# Altium project ALCT_MEZ_LX150T.PrjPcb (part 3 of 5)

## Sheet MGT.SchDoc: FPGA MGTs
size B; Organization: UCLA High Energy Physics; DocumentNumber: 6; Revision: 2.0; SheetNumber: 6; SheetTotal: 12
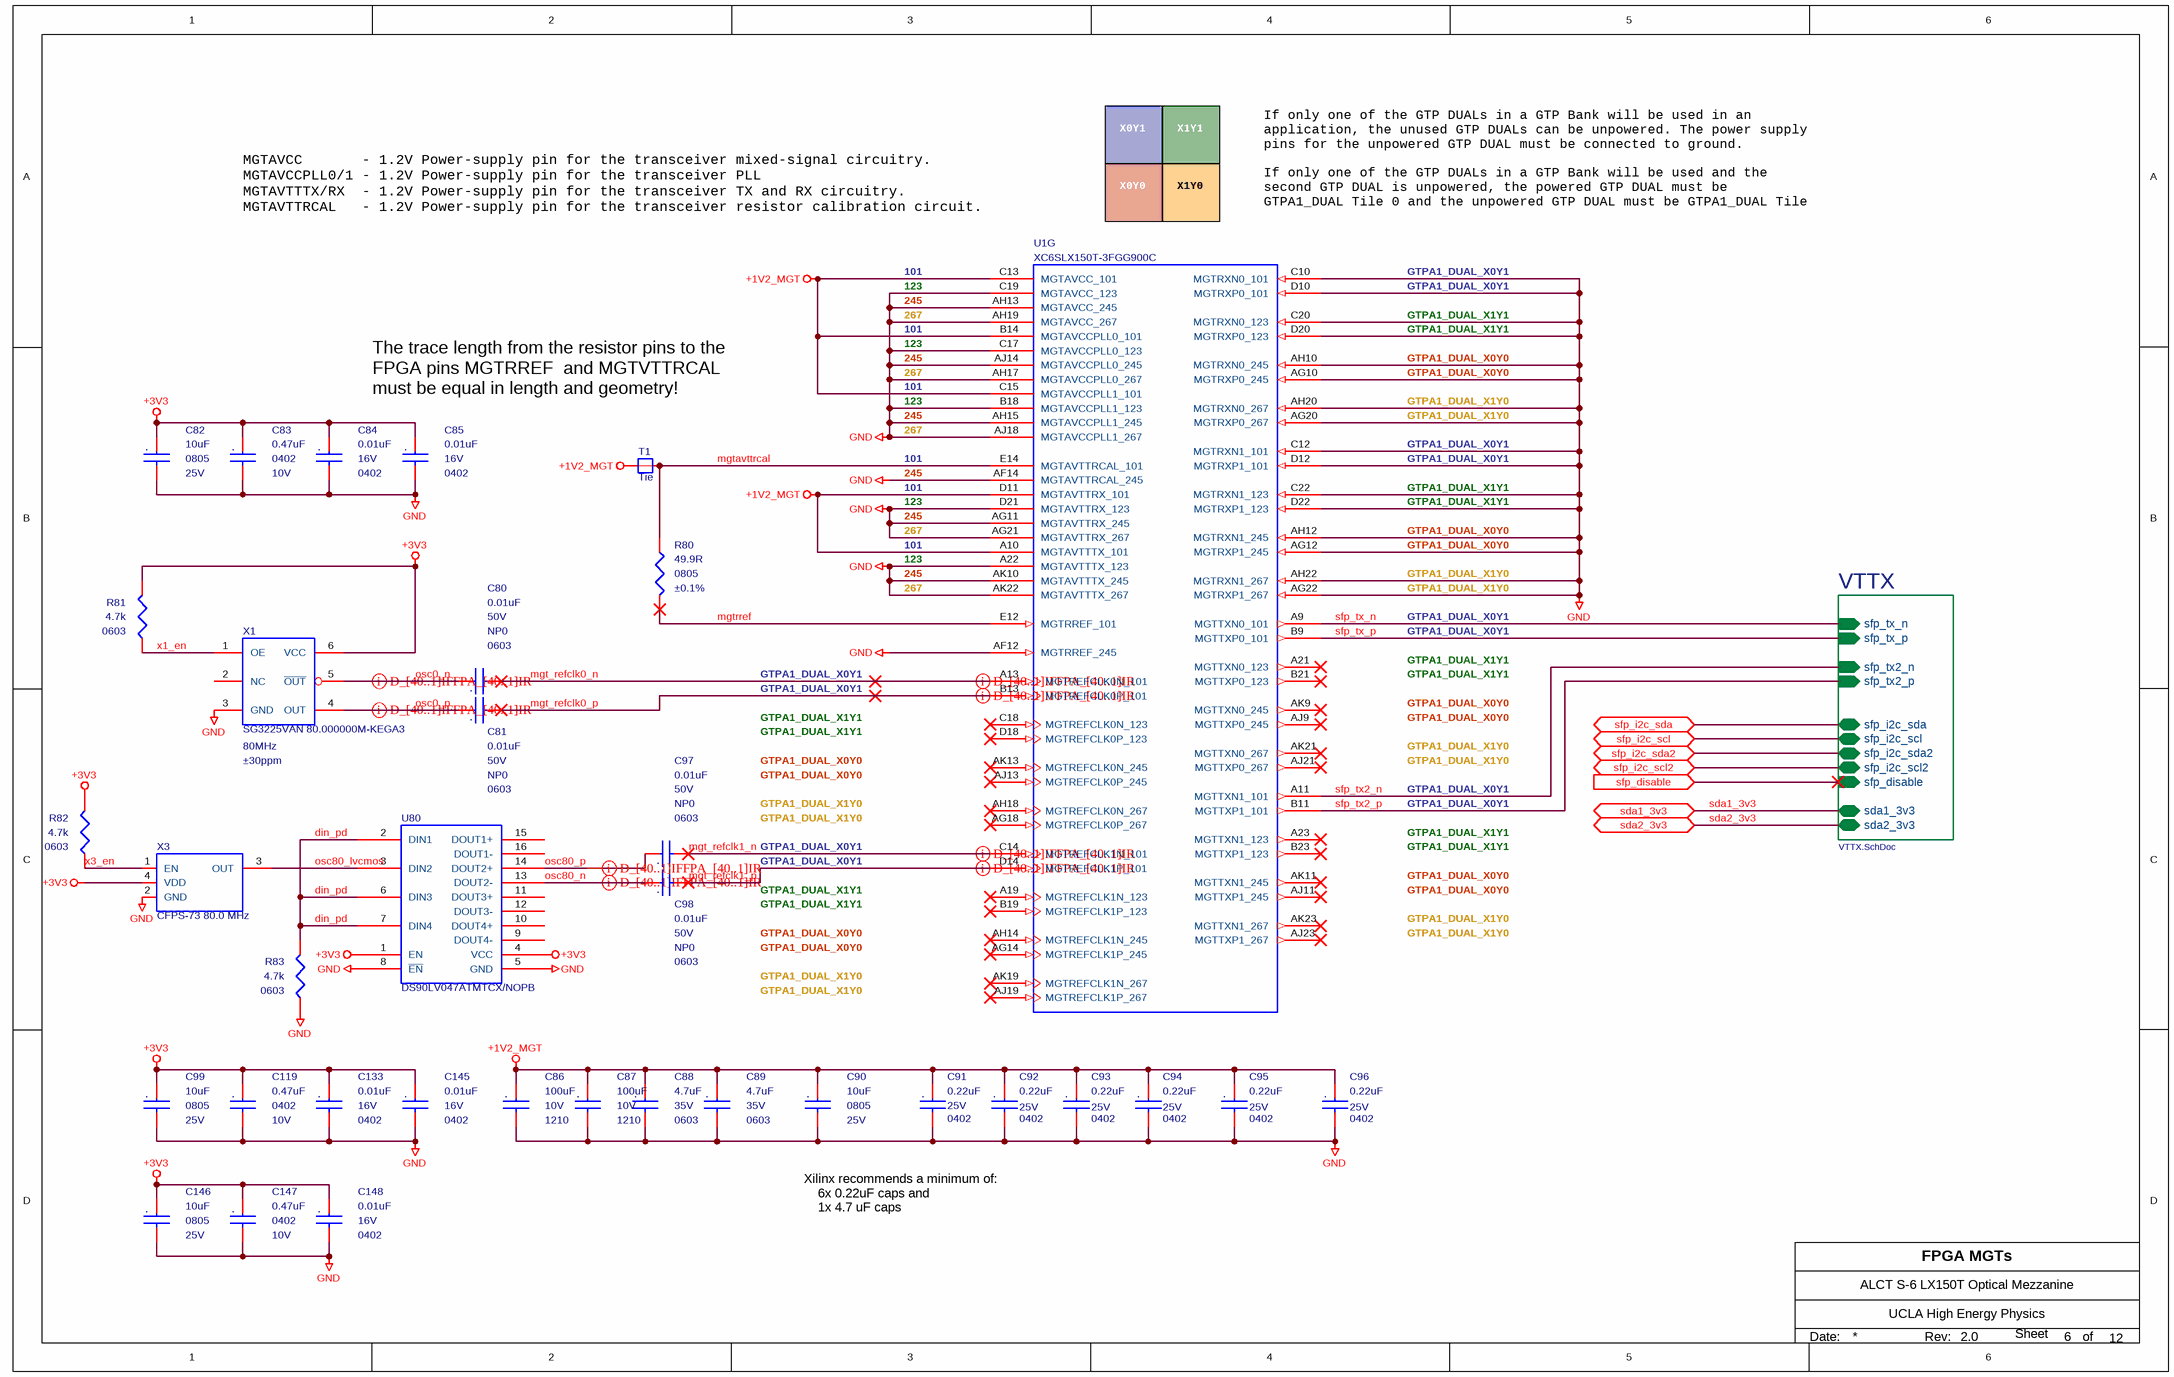
[diagram p10: MGT.SchDoc]

### Parts
C80  0.01uF  Temperature Coefficient: NP0  package: 0603  Voltage - Rated: 50V  [MC_S6/SM/C_0603_IPC]
C81  0.01uF  Temperature Coefficient: NP0  package: 0603  Voltage - Rated: 50V  [MC_S6/SM/C_0603_IPC]
C82  10uF  Voltage - Rated: 25V  package: 0805  [MC_S6/SM/C_0805_IPC]
C83  0.47uF  Voltage - Rated: 10V  package: 0402  [MC_S6/SM/C_0402_IPC]
C84  0.01uF  Voltage - Rated: 16V  package: 0402  [MC_S6/SM/C_0402_IPC]
C85  0.01uF  Voltage - Rated: 16V  package: 0402  [MC_S6/SM/C_0402_IPC]
C86  100uF  Voltage - Rated: 10V  package: 1210  [MC_S6/SM/C_1210_IPC]
C87  100uF  Voltage - Rated: 10V  package: 1210  [MC_S6/SM/C_1210_IPC]
C88  4.7uF  Voltage - Rated: 35V  package: 0603  [MC_S6/SM/C_0603_IPC]
C89  4.7uF  Voltage - Rated: 35V  package: 0603  [MC_S6/SM/C_0603_IPC]
C90  10uF  Voltage - Rated: 25V  package: 0805  [MC_S6/SM/C_0805_IPC]
C91  0.22uF  Voltage - Rated: 25V  package: 0402  [MC_S6/SM/C_0402_IPC]
C92  0.22uF  Voltage - Rated: 25V  package: 0402  [MC_S6/SM/C_0402_IPC]
C93  0.22uF  Voltage - Rated: 25V  package: 0402  [MC_S6/SM/C_0402_IPC]
C94  0.22uF  Voltage - Rated: 25V  package: 0402  [MC_S6/SM/C_0402_IPC]
C95  0.22uF  Voltage - Rated: 25V  package: 0402  [MC_S6/SM/C_0402_IPC]
C96  0.22uF  Voltage - Rated: 25V  package: 0402  [MC_S6/SM/C_0402_IPC]
C97  0.01uF  Temperature Coefficient: NP0  package: 0603  Voltage - Rated: 50V  [MC_S6/SM/C_0603_IPC]
C98  0.01uF  Temperature Coefficient: NP0  package: 0603  Voltage - Rated: 50V  [MC_S6/SM/C_0603_IPC]
C99  10uF  Voltage - Rated: 25V  package: 0805  [MC_S6/SM/C_0805_IPC]
C119  0.47uF  Voltage - Rated: 10V  package: 0402  [MC_S6/SM/C_0402_IPC]
C133  0.01uF  Voltage - Rated: 16V  package: 0402  [MC_S6/SM/C_0402_IPC]
C145  0.01uF  Voltage - Rated: 16V  package: 0402  [MC_S6/SM/C_0402_IPC]
C146  10uF  Voltage - Rated: 25V  package: 0805  [MC_S6/SM/C_0805_IPC]
C147  0.47uF  Voltage - Rated: 10V  package: 0402  [MC_S6/SM/C_0402_IPC]
C148  0.01uF  Voltage - Rated: 16V  package: 0402  [MC_S6/SM/C_0402_IPC]
R80  49.9R  Tolerance: ±0.1%  Supplier Device Package: 0805  [MC_S6/SM/R_0805_IPC]
R81  4.7k  Supplier Device Package: 0603  [MC_S6/SM/R_0603_IPC]
R82  4.7k  Supplier Device Package: 0603  [MC_S6/SM/R_0603_IPC]
R83  4.7k  Supplier Device Package: 0603  [MC_S6/SM/R_0603_IPC]
T1  Tie  [MC_S6/TH/TIE_VIA]  (net tie, no BOM)
U1  XC6SLX150T-3FGG900C  [MC_S6/BGA/FGG900]  (part G of 13)
U80  DS90LV047ATMTCX/NOPB  [MC_S6/SM/TSSOP16]
X1  SG3225VAN 80.000000M-KEGA3  Frequency: 80MHz  Frequency Stability: ±30ppm  [MC_S6/SM/XTAL-LVDS-3.2-2.5]
X3  CFPS-73 80.0 MHz  [MC_S6/SM/XTAL-7x5.08]

### Sub-sheets
VTTX = VTTX.SchDoc: sfp_tx2_n (in), sfp_tx2_p (in), sfp_i2c_sda2 (bidir), sfp_i2c_scl (bidir), sfp_i2c_sda (bidir), sfp_i2c_scl2 (bidir), sfp_tx_n (in), sfp_tx_p (in), sfp_disable (in), sda2_3v3 (bidir), sda1_3v3 (bidir)

### Ports
sda1_3v3 (bidir), sda2_3v3 (bidir), sfp_disable (in), sfp_i2c_scl2 (bidir), sfp_i2c_scl (bidir), sfp_i2c_sda2 (bidir), sfp_i2c_sda (bidir)

### Nets
+1V2_MGT: C86.1 C87.1 C88.1 C89.1 C90.1 C91.1 C92.1 C93.1 C94.1 C95.1 C96.1 T1.2 U1.A10(MGTAVTTTX_101) U1.B14(MGTAVCCPLL0_101) U1.C13(MGTAVCC_101) U1.C15(MGTAVCCPLL1_101) U1.D11(MGTAVTTRX_101)
+3V3: C82.1 C83.1 C84.1 C85.1 C99.1 C119.1 C133.1 C145.1 C146.1 C147.1 C148.1 R81.1 R82.1 U80.1(EN) U80.4(VCC) X1.6(VCC) X3.4(VDD)
GND: C82.2 C83.2 C84.2 C85.2 C86.2 C87.2 C88.2 C89.2 C90.2 C91.2 C92.2 C93.2 C94.2 C95.2 C96.2 C99.2 C119.2 C133.2 C145.2 C146.2 C147.2 C148.2 R83.2 U1.A22(MGTAVTTTX_123) U1.AF12(MGTRREF_245) U1.AF14(MGTAVTTRCAL_245) U1.AG10(MGTRXP0_245) U1.AG11(MGTAVTTRX_245) U1.AG12(MGTRXP1_245) U1.AG20(MGTRXP0_267) U1.AG21(MGTAVTTRX_267) U1.AG22(MGTRXP1_267) U1.AH10(MGTRXN0_245) U1.AH12(MGTRXN1_245) U1.AH13(MGTAVCC_245) U1.AH15(MGTAVCCPLL1_245) U1.AH17(MGTAVCCPLL0_267) U1.AH19(MGTAVCC_267) U1.AH20(MGTRXN0_267) U1.AH22(MGTRXN1_267) U1.AJ14(MGTAVCCPLL0_245) U1.AJ18(MGTAVCCPLL1_267) U1.AK10(MGTAVTTTX_245) U1.AK22(MGTAVTTTX_267) U1.B18(MGTAVCCPLL1_123) U1.C10(MGTRXN0_101) U1.C12(MGTRXN1_101) U1.C17(MGTAVCCPLL0_123) U1.C19(MGTAVCC_123) U1.C20(MGTRXN0_123) U1.C22(MGTRXN1_123) U1.D10(MGTRXP0_101) U1.D12(MGTRXP1_101) U1.D20(MGTRXP0_123) U1.D21(MGTAVTTRX_123) U1.D22(MGTRXP1_123) U80.5(GND) U80.8(~{EN}) X1.3(GND) X3.2(GND)
din_pd: R83.1 U80.2(DIN1) U80.6(DIN3) U80.7(DIN4)
mgt_refclk0_n: C80.2 U1.A13(MGTREFCLK0N_101)
mgt_refclk0_p: C81.2 U1.B13(MGTREFCLK0P_101)
mgt_refclk1_n: C97.2 U1.C14(MGTREFCLK1N_101)
mgt_refclk1_p: C98.2 U1.D14(MGTREFCLK1P_101)
mgtavttrcal: R80.1 T1.1 U1.E14(MGTAVTTRCAL_101)
mgtrref: R80.2 U1.E12(MGTRREF_101)
osc0_n: C80.1 X1.5(~{OUT})
osc0_p: C81.1 X1.4(OUT)
osc80_lvcmos: U80.3(DIN2) X3.3(OUT)
osc80_n: C98.1 U80.13(DOUT2-)
osc80_p: C97.1 U80.14(DOUT2+)
sda1_3v3: port sda1_3v3, sheet VTTX/sda1_3v3
sda2_3v3: port sda2_3v3, sheet VTTX/sda2_3v3
sfp_disable: port sfp_disable, sheet VTTX/sfp_disable
sfp_i2c_scl: port sfp_i2c_scl, sheet VTTX/sfp_i2c_scl
sfp_i2c_scl2: port sfp_i2c_scl2, sheet VTTX/sfp_i2c_scl2
sfp_i2c_sda: port sfp_i2c_sda, sheet VTTX/sfp_i2c_sda
sfp_i2c_sda2: port sfp_i2c_sda2, sheet VTTX/sfp_i2c_sda2
sfp_tx2_n: U1.A11(MGTTXN1_101) ; sheet VTTX/sfp_tx2_n
sfp_tx2_p: U1.B11(MGTTXP1_101) ; sheet VTTX/sfp_tx2_p
sfp_tx_n: U1.A9(MGTTXN0_101) ; sheet VTTX/sfp_tx_n
sfp_tx_p: U1.B9(MGTTXP0_101) ; sheet VTTX/sfp_tx_p
x1_en: R81.2 X1.1(OE)
x3_en: R82.2 X3.1(EN)

Not connected (* = marked no-connect by the designer): U1 A19(MGTREFCLK1N_123)* A21(MGTTXN0_123)* A23(MGTTXN1_123)* AG14(MGTREFCLK1P_245)* AG18(MGTREFCLK0P_267)* AH14(MGTREFCLK1N_245)* AH18(MGTREFCLK0N_267)* AJ9(MGTTXP0_245)* AJ11(MGTTXP1_245)* AJ13(MGTREFCLK0P_245)* AJ19(MGTREFCLK1P_267)* AJ21(MGTTXP0_267)* AJ23(MGTTXP1_267)* AK9(MGTTXN0_245)* AK11(MGTTXN1_245)* AK13(MGTREFCLK0N_245)* AK19(MGTREFCLK1N_267)* AK21(MGTTXN0_267)* AK23(MGTTXN1_267)* B19(MGTREFCLK1P_123)* B21(MGTTXP0_123)* B23(MGTTXP1_123)* C18(MGTREFCLK0N_123)* D18(MGTREFCLK0P_123)*; U80 9(DOUT4-) 10(DOUT4+) 11(DOUT3+) 12(DOUT3-) 15(DOUT1+) 16(DOUT1-); X1 2(NC)

### Layout directives
differential pair: mgt_refclk0_n, mgt_refclk0_p, mgt_refclk1_n, mgt_refclk1_p, osc0_n, osc0_p, osc80_n, osc80_p

### Notes on the sheet
- X0Y1
- X1Y1
- (near U1) MGTAVCC       - 1.2V Power-supply pin for the transceiver mixed-signal circuitry.
  MGTAVCCPLL0/1 - 1.2V Power-supply pin for the transceiver PLL
  MGTAVTTTX/RX  - 1.2V Power-supply pin for the transceiver TX and RX circuitry.
  MGTAVTTRCAL   - 1.2V Power-supply pin for the transceiver resistor calibration circuit.
- X0Y0
- X1Y0
- If only one of the GTP DUALs in a GTP Bank will be used in an application, the unused GTP DUALs can be unpowered. The power supply pins for the unpowered GTP DUAL must be connected to ground.
  If only one of the GTP DUALs in a GTP Bank will be used and the second GTP DUAL is unpowered, the powered GTP DUAL must be GTPA1_DUAL Tile 0 and the unpowered GTP DUAL must be GTPA1_DUAL Tile 1.
- 101
- 123
- 245
- 267
- GTPA1_DUAL_X0Y1
- GTPA1_DUAL_X1Y1
- GTPA1_DUAL_X0Y0
- (near C85) The trace length from the resistor pins to the FPGA pins MGTRREF  and MGTVTTRCAL must be equal in length and geometry!
- GTPA1_DUAL_X1Y0
- Xilinx recommends a minimum of:
  6x 0.22uF caps and
  1x 4.7 uF caps
- Date:
- Rev:
- of
- Sheet
- (in symbol C0402C103K4RACTU) .
- (in symbol C0603C103J3GACTU) .
- (in symbol GRM21BR61E106KA73L) .
- (in symbol GRM155R61A474KE15J) .
- (in symbol GRM155R71C224KA12D) .
- (in symbol GRM188R6YA475KE15D) .
- (in symbol LMK325BJ107MM-T) .

### Library data of the parts
C80 C81 C97 C98 = C0603C103J3GACTU: CAP CER 10000PF 50V NP0 0603; Manufacturer: KEMET; Tolerance: ±5%; Supplier 1: Digi-Key; Manufacturer Part Number: C0603C103J3GACTU; RoHS: RoHS Compliant; Category: Capacitors; Stock 1: 190820; Pricing 1: 1=0.33, 10=0.231, 100=0.1385, 500=0.10388, 1000=0.08772 (USD); Packaging: Cut Tape (CT); Part Status: Active; Capacitance: 10000pF; Operating Temperature: -55°C ~ 125°C; Features: Low ESL; Ratings: -; Applications: General Purpose; Mounting Type: Surface Mount, MLCC; Package / Case: 0603 (1608 Metric); Size / Dimension: 0.063" L x 0.031" W (1.60mm x 0.80mm); Height - Seated (Max): -; Thickness (Max): 0.034" (0.87mm); Lead Spacing: -; Lead Style: -; ComponentLink1URL: http://www.kemet.com/docfinder?Partnumber=C0603C103J3GACTU; ComponentLink1Description: http://www.kemet.com/docfinder?Partnumber=C0603C103J3GACTU; Supplier 2: Digi-Key; Stock 2: 190820; Pricing 2: 1=0.33, 10=0.231, 100=0.1385, 500=0.10388, 1000=0.08772 (USD); Supplier Part Number 1: 399-7838-1-ND; Supplier Part Number 2: 399-7838-6-ND; Failure Rate: -
C82 C90 C99 C146 = GRM21BR61E106KA73L: CAP CER 10UF 25V X5R 0805; Manufacturer: Murata Electronics North America; Capacitance: 10µF; Tolerance: ±10%; Supplier 1: Digi-Key; Manufacturer Part Number: GRM21BR61E106KA73L; RoHS: RoHS Compliant; Category: Capacitors; Stock 1: 607428; Pricing 1: 1=0.19, 10=0.13, 50=0.0748, 100=0.0618, 250=0.052, 500=0.04356, 1000=0.03575 (USD); Packaging: Cut Tape (CT); Part Status: Active; Temperature Coefficient: X5R; Operating Temperature: -55°C ~ 85°C; Features: -; Ratings: -; Applications: General Purpose; Mounting Type: Surface Mount, MLCC; Package / Case: 0805 (2012 Metric); Size / Dimension: 0.079" L x 0.049" W (2.00mm x 1.25mm); Height - Seated (Max): -; Thickness (Max): 0.053" (1.35mm); Lead Spacing: -; Lead Style: -; ComponentLink1URL: http://www.murata.com/~/media/webrenewal/support/library/catalog/products/capacitor/mlcc/c02e.pdf; ComponentLink1Description: http://www.murata.com/~/media/webrenewal/support/library/catalog/products/capacitor/mlcc/c02e.pdf; Supplier 2: Digi-Key; Supplier Part Number 1: 490-5523-1-ND; Supplier Part Number 2: 490-5523-6-ND
C83 C119 C147 = GRM155R61A474KE15J: CAP CER 0.47UF 10V X5R 0402; Manufacturer: Murata Electronics North America; Capacitance: 0.47µF; Tolerance: ±10%; Supplier 1: Digi-Key; Manufacturer Part Number: GRM155R61A474KE15J; RoHS: RoHS Compliant; Category: Capacitors; Stock 1: 35266; Pricing 1: 1=0.1, 10=0.074, 100=0.0329, 500=0.02348, 1000=0.01845, 2500=0.01678, 5000=0.01543 (USD); Packaging: Cut Tape (CT); Part Status: Active; Operating Temperature: -55°C ~ 85°C; Features: -; Ratings: -; Applications: General Purpose; Mounting Type: Surface Mount, MLCC; Package / Case: 0402 (1005 Metric); Size / Dimension: 0.039" L x 0.020" W (1.00mm x 0.50mm); Height - Seated (Max): -; Thickness (Max): 0.022" (0.55mm); Lead Spacing: -; ComponentLink1URL: http://www.murata.com/~/media/webrenewal/support/library/catalog/products/capacitor/mlcc/c02e.ashx; ComponentLink1Description: http://www.murata.com/~/media/webrenewal/support/library/catalog/products/capacitor/mlcc/c02e.ashx; Supplier 2: Digi-Key; Stock 2: 35286; Pricing 2: 1=0.1, 10=0.074, 100=0.0329, 500=0.02348, 1000=0.01845, 2500=0.01678, 5000=0.01543 (USD); Supplier Part Number 1: 490-6305-1-ND; Supplier Part Number 2: 490-6305-6-ND; Temperature Coefficient: X5R
C84 C85 C133 C145 C148 = C0402C103K4RACTU: CAP CER 10nF 16V X7R 0402; Manufacturer: KEMET; Capacitance: 10000pF; Tolerance: ±10%; Supplier 1: Digi-Key; Manufacturer Part Number: C0402C103K4RACTU; RoHS: RoHS Compliant; Category: Capacitors; Stock 1: 605739; Pricing 1: 1=0.1, 10=0.02, 25=0.0144, 50=0.0108, 100=0.0088, 250=0.00732, 500=0.00626, 1000=0.00492, 5000=0.00412 (USD); Packaging: Cut Tape (CT); Part Status: Active; Temperature Coefficient: X7R; Operating Temperature: -55°C ~ 125°C; Features: -; Ratings: -; Applications: General Purpose; Failure Rate: -; Mounting Type: Surface Mount, MLCC; Package / Case: 0402 (1005 Metric); Size / Dimension: 0.039" L x 0.020" W (1.00mm x 0.50mm); Height - Seated (Max): -; Thickness (Max): 0.022" (0.55mm); Lead Spacing: -; Lead Style: -; ComponentLink1URL: http://www.kemet.com/docfinder?Partnumber=C0402C103K4RACTU; ComponentLink1Description: http://www.kemet.com/docfinder?Partnumber=C0402C103K4RACTU; Supplier 2: Digi-Key; Stock 2: 605739; Pricing 2: 1=0.1, 10=0.02, 25=0.0144, 50=0.0108, 100=0.0088, 250=0.00732, 500=0.00626, 1000=0.00492, 5000=0.00412 (USD); Supplier Part Number 1: 399-1038-1-ND; Supplier Part Number 2: 399-1038-6-ND
C86 C87 = LMK325BJ107MM-T: CAP CER 100UF 10V X5R 1210; Manufacturer: Taiyo Yuden; Capacitance: 100µF; Tolerance: ±20%; Supplier 1: Digi-Key; Manufacturer Part Number: LMK325BJ107MM-T; RoHS: RoHS Compliant; Category: Capacitors; Stock 1: 345948; Pricing 1: 1=1.15, 10=0.909, 25=0.8332, 50=0.7878, 100=0.6818, 250=0.60608 (USD); Packaging: Cut Tape (CT); Part Status: Active; Temperature Coefficient: X5R; Operating Temperature: -55°C ~ 85°C; Features: -; Ratings: -; Applications: General Purpose; Mounting Type: Surface Mount, MLCC; Package / Case: 1210 (3225 Metric); Size / Dimension: 0.126" L x 0.098" W (3.20mm x 2.50mm); Height - Seated (Max): -; Thickness (Max): 0.106" (2.70mm); Lead Spacing: -; Lead Style: -; ComponentLink1URL: http://www.yuden.co.jp/productdata/catalog/en/mlcc_all_e.pdf; ComponentLink1Description: http://www.yuden.co.jp/productdata/catalog/en/mlcc_all_e.pdf; Supplier 2: Digi-Key; Stock 2: 345948; Pricing 2: 1=1.16, 10=0.914, 25=0.8376, 50=0.792, 100=0.6855, 250=0.60932 (USD); Supplier Part Number 1: 587-1965-1-ND; Supplier Part Number 2: 587-1965-6-ND
C88 C89 = GRM188R6YA475KE15D: CAP CER 4.7UF 35V X5R 0603; Manufacturer: Murata; Capacitance: 4.7µF; Tolerance: ±10%; Product Training Modules: High-Cap Multilayer Ceramic Capacitors; Featured Product: GA3 Safety Recognized Capacitors; EDA / CAD Models: Download from Accelerated Designs; Online Catalog: GRM Series; Other Names: 490-7205-2; Supplier 1: Digikey; Manufacturer Part Number: GRM188R6YA475KE15D; Category: Capacitors; Stock 1: 180441; Pricing 1: 1=0.32, 10=0.264, 50=0.1486, 100=0.132, 250=0.099, 500=0.0875, 1000=0.0776 (USD); Packaging: Tape & Reel (TR); Temperature Coefficient: X5R; Operating Temperature: -55°C ~ 85°C; Applications: General Purpose; Mounting Type: Surface Mount, MLCC; Package / Case: 0603 (1608 Metric); Size / Dimension: 0.063" L x 0.031" W (1.60mm x 0.80mm); Thickness (Max): 0.031" (0.80mm); ComponentLink1URL: https://datasheet.ciiva.com/46444/1769893-46444984.pdf; ComponentLink1Description: https://datasheet.ciiva.com/46444/1769893-46444984.pdf; Supplier 2: Digikey; Stock 2: 180441; Pricing 2: 1=0.32, 10=0.264, 50=0.1486, 100=0.132, 250=0.099, 500=0.0875, 1000=0.0776 (USD); Supplier Part Number 1: 490-7205-1-ND; Supplier Part Number 2: 490-7205-6-ND; Standard Package: 4,000; Family: Ceramic Capacitors; Series: GRM; ComponentLink2URL: https://datasheet.ciiva.com/46444/1769893-46444985.pdf; ComponentLink2Description: https://datasheet.ciiva.com/46444/1769893-46444985.pdf; ComponentLink3URL: https://datasheet.ciiva.com/14906/partnumbering-e-01-14906426.pdf; ComponentLink3Description: https://datasheet.ciiva.com/14906/partnumbering-e-01-14906426.pdf; ComponentLink4URL: https://datasheet.ciiva.com/14906/partnumbering-e-01-14906427.pdf; ComponentLink4Description: https://datasheet.ciiva.com/14906/partnumbering-e-01-14906427.pdf; ComponentLink5URL: https://datasheet.ciiva.com/14906/partnumbering-e-01-14906428.pdf; ComponentLink5Description: https://datasheet.ciiva.com/14906/partnumbering-e-01-14906428.pdf
C91-C96 = GRM155R71C224KA12D: CAP CER 0.22UF 15V X7R 0402; Manufacturer: Murata Electronics North America; Capacitance: 0.22µF; Tolerance: ±10%; Supplier 1: Digi-Key; Manufacturer Part Number: GRM155R71C224KA12D; RoHS: RoHS Compliant; Category: Capacitors; Stock 1: 1853641; Pricing 1: 1=0.1, 10=0.063, 100=0.0279, 500=0.0199, 1000=0.01564, 2500=0.01422, 5000=0.01308 (USD); Packaging: Cut Tape (CT); Part Status: Active; Operating Temperature: -55°C ~ 125°C; Features: -; Ratings: -; Applications: General Purpose; Mounting Type: Surface Mount, MLCC; Package / Case: 0402 (1005 Metric); Size / Dimension: 0.039" L x 0.020" W (1.00mm x 0.50mm); Height - Seated (Max): -; Thickness (Max): 0.022" (0.55mm); Lead Spacing: -; Lead Style: -; ComponentLink1URL: http://www.murata.com/~/media/webrenewal/support/library/catalog/products/capacitor/mlcc/c02e.ashx; ComponentLink1Description: http://www.murata.com/~/media/webrenewal/support/library/catalog/products/capacitor/mlcc/c02e.ashx; Supplier 2: Digi-Key; Stock 2: 1854141; Pricing 2: 1=0.1, 10=0.063, 100=0.0279, 500=0.0199, 1000=0.01564, 2500=0.01422, 5000=0.01308 (USD); Supplier Part Number 1: 490-5418-1-ND; Supplier Part Number 2: 490-5418-6-ND; Temperature Coefficient: X7R
R80 = ERA-6AEB49R9V: RES SMD 49.9 OHM 0.1% 1/8W 0805; Manufacturer: Panasonic Electronic Components; Resistance (Ohms): 49.9; Power (Watts): 0.125W, 1/8W; Temperature Coefficient: ±25ppm/°C; Supplier 1: Digi-Key; Manufacturer Part Number: ERA-6AEB49R9V; RoHS: RoHS Compliant; Category: Resistors; Stock 1: 51151; Pricing 1: 1=0.53, 50=0.21, 100=0.162, 250=0.126, 500=0.0888, 1000=0.0648 (USD); Packaging: Cut Tape (CT); Part Status: Active; Composition: Thin Film; Features: Automotive AEC-Q200; Operating Temperature: -55°C ~ 155°C; Package / Case: 0805 (2012 Metric); Size / Dimension: 0.079" L x 0.049" W (2.00mm x 1.25mm); Height - Seated (Max): 0.024" (0.60mm); Number of Terminations: 2; Failure Rate: -; ComponentLink1URL: https://industrial.panasonic.com/cdbs/www-data/pdf/RDA0000/AOA0000C237.pdf; ComponentLink1Description: https://industrial.panasonic.com/cdbs/www-data/pdf/RDA0000/AOA0000C237.pdf; Supplier 2: Digi-Key; Stock 2: 51151; Pricing 2: 1=0.53, 50=0.21, 100=0.162, 250=0.126, 500=0.0888, 1000=0.0648 (USD); Supplier Part Number 1: P49.9DACT-ND; Supplier Part Number 2: P49.9DADKR-ND
R81-R83 = CR0603-FX-4701ELF: RES SMD 4.7K OHM 1% 1/10W 0603; Manufacturer: Bourns Inc.; Power (Watts): 0.1W, 1/10W; Temperature Coefficient: ±100ppm/°C; Supplier 1: Digi-Key; Manufacturer Part Number: CR0603-FX-4701ELF; RoHS: RoHS Compliant; Category: Resistors; Stock 1: 43560; Pricing 1: 1=0.1, 10=0.021, 100=0.0086, 1000=0.00385, 2500=0.00334 (USD); Packaging: Cut Tape (CT); Part Status: Active; Resistance (Ohms): 4.7k; Composition: Thick Film; Features: Moisture Resistant; Operating Temperature: -55°C ~ 155°C; Package / Case: 0603 (1608 Metric); Size / Dimension: 0.063" L x 0.031" W (1.60mm x 0.80mm); Height - Seated (Max): 0.022" (0.55mm); Failure Rate: -; ComponentLink1URL: http://www.bourns.com/docs/Product-Datasheets/CHPREZTR.pdf; ComponentLink1Description: http://www.bourns.com/docs/Product-Datasheets/CHPREZTR.pdf; Supplier 2: Digi-Key; Stock 2: 43560; Pricing 2: 1=0.1, 10=0.021, 100=0.0086, 1000=0.00385, 2500=0.00334 (USD); Supplier Part Number 1: CR0603-FX-4701ELFCT-ND; Supplier Part Number 2: CR0603-FX-4701ELFDKR-ND; Tolerance: ±1%
T1 = NET TIE VIA
U1 = XC6SLX150T-3FGG900C: Spartan-6 LXT 1.2V FPGA, 540 User I/Os, 900-Ball Chip-Scale BGA (1.0mm Pitch), Speed Grade 3, Commercial Grade, Pb-Free; Manufacturer: Xilinx Inc.; Number of I/O: 540; Voltage - Supply: 1.14 V ~ 1.26 V; DatasheetVersion: ver1.6, Nov-2010; PackageVersion: ver1.4, Nov-2009; PackageReference: FGG900; PackageDescription: 900-Ball Fine-Pitch Ball Grid Array (FGG900) - Pb-Free; Code_JEDEC: MS-034-AAN-1; Code_IPC: BGA100P30X30-900; ComponentLink1Description: Manufacturer URL; ComponentLink1URL: http://www.xilinx.com/; ComponentLink2Description: Spartan-6 Datasheet; ComponentLink2URL: http://www.xilinx.com/support/documentation/data_sheets/ds160.pdf; ComponentLink3Description: Spartan-6 Documents; ComponentLink3URL: http://www.xilinx.com/support/documentation/spartan-6.htm; Supplier 1: Digi-Key; Manufacturer Part Number: XC6SLX150T-3FGG900C; RoHS: RoHS Compliant; Category: Integrated Circuits (ICs); Stock 1: 0; Pricing 1: 27=287.3 (USD); Part Status: Active; Mounting Type: Surface Mount; Operating Temperature: 0°C ~ 85°C (TJ); Package / Case: 900-BBGA; Supplier Device Package: 900-FBGA (31x31); ComponentLink4URL: http://www.xilinx.com/support/documentation/data_sheets/ds162.pdf; ComponentLink4Description: http://www.xilinx.com/support/documentation/data_sheets/ds162.pdf; Supplier Part Number 1: XC6SLX150T-3FGG900C-ND
U80 = DS90LV047ATMTCX: IC LINE DVR 3V QUAD DIFF 16TSSOP; Manufacturer: TI National Semiconductor; Description: LVDS Driver 0.45V 16-Pin TSSOP T/R; Data Rate: 400Mbps; Number of Channels: 4; Power Consumption: 14W; Operating Supply Voltage: 3.3V; Propagation Delay: 1.7ns; Max Power Dissipation: 866mW; Max Supply Voltage: 3.6V; Operating Supply Current: 30mA; Max Supply Current: 20mA; Supplier 1: Digi-Key; Manufacturer Part Number: DS90LV047ATMTCX/NOPB; Stock 1: 29207; Pricing 1: 1=2.91, 10=2.618, 100=2.104, 500=1.7286, 1000=1.43227 (USD); Mount: Surface Mount; Case/Package: TSSOP; Number of Pins: 16; Weight: 0.002222oz; Min Operating Temperature: -40°C; Max Operating Temperature: 85°C; Packaging: Tape and Reel; Number of Receivers: 4; Number of Elements: 4; Min Supply Voltage: 3V; Number of Drivers: 4; Turn-On Delay Time: 1.7ns; Power Dissipation: 866mW; Radiation Hardening: No; Lead Free: Lead Free; REACH SVHC: No SVHC; ComponentLink1URL: https://datasheet.ciiva.com/12096/snls044b-72207-12096627.pdf; ComponentLink1Description: https://datasheet.ciiva.com/12096/snls044b-72207-12096627.pdf; ComponentLink2URL: https://datasheet.ciiva.com/3151/ds90lv047a-3151495.pdf; ComponentLink2Description: https://datasheet.ciiva.com/3151/ds90lv047a-3151495.pdf; ComponentLink3URL: https://datasheet.ciiva.com/6635/ds90lv047a-6635303.pdf; ComponentLink3Description: https://datasheet.ciiva.com/6635/ds90lv047a-6635303.pdf; ComponentLink4URL: https://datasheet.ciiva.com/6635/ds90lv047a-6635304.pdf; ComponentLink4Description: https://datasheet.ciiva.com/6635/ds90lv047a-6635304.pdf; ComponentLink5URL: https://datasheet.ciiva.com/6635/ds90lv047a-6635305.pdf; ComponentLink5Description: https://datasheet.ciiva.com/6635/ds90lv047a-6635305.pdf; ComponentLink6URL: https://datasheet.ciiva.com/15133/getdatasheetpartid-55660-15133789.pdf; ComponentLink6Description: https://datasheet.ciiva.com/15133/getdatasheetpartid-55660-15133789.pdf; Supplier Part Number 1: DS90LV047ATMTCX/NOPBDKR-ND
X1 = SG3225VAN 80.000000M-KEGA3: OSC 80.0000MHZ LVDS SMD; Manufacturer: EPSON; Function: Enable/Disable; Voltage - Supply: 2.5 V ~ 3.3 V; Current - Supply (Max): 30mA; Current - Supply (Disable) (Max): 20mA; Supplier 1: Digi-Key; Manufacturer Part Number: SG3225VAN 80.000000M-KEGA3; RoHS: RoHS Compliant; Category: Crystals, Oscillators, Resonators; Stock 1: 107; Pricing 1: 1=2.29, 10=2.241, 50=2.134, 100=1.8673 (USD); Packaging: Cut Tape (CT); Part Status: Active; Type: XO (Standard); Output: LVDS; Operating Temperature: -40°C ~ 85°C; Ratings: -; Mounting Type: Surface Mount; Package / Case: 6-SMD, No Lead (DFN, LCC); Size / Dimension: 0.126" L x 0.098" W (3.20mm x 2.50mm); Height - Seated (Max): 0.047" (1.20mm); ComponentLink1URL: https://support.epson.biz/td/api/doc_check.php?dl=brief_SG3225EAN_en.pdf; ComponentLink1Description: https://support.epson.biz/td/api/doc_check.php?dl=brief_SG3225EAN_en.pdf; Supplier 2: Digi-Key; Stock 2: 107; Pricing 2: 1=2.29, 10=2.241, 50=2.134, 100=1.8673 (USD); Supplier Part Number 1: SER3935CT-ND; Supplier Part Number 2: SER3935DKR-ND
X3 = LFSPXO009441: XTAL, 80MHz, CMOS; Manufacturer: IQD; Manufacturer Part Number: LFSPXO009441REEL; Description: Oscillator XO 80MHz ±50ppm 30pF HCMOS 55% 3.3V 4-Pin CSMD T/R; Load Capacitance: 30pF; Frequency Stability: 50ppm; Supplier 1: Digi-Key; Stock 1: 827; Pricing 1: 1=2.72, 10=2.657, 50=2.53, 100=2.2138, 500=2.1505 (USD); Case/Package: CSMD; Number of Pins: 4; Min Operating Temperature: 0°C; Max Operating Temperature: 70°C; Frequency: 80MHz; Packaging: Tape and Reel; Length: 7.2mm; Depth: 5.2mm; ComponentLink1URL: http://components.arrow.com/part/dataview/0323_02291251; ComponentLink1Description: http://components.arrow.com/part/dataview/0323_02291251; Supplier Part Number 1: 1923-1130-6-ND

## Sheet VTTX.SchDoc: Optical SFP+
size A; Organization: UCLA High Energy Physics; DocumentNumber: 7; Revision: 2.0; SheetNumber: 7; SheetTotal: 12; CurrentDate: 8/7/2018; ModifiedDate: 8/20/2018
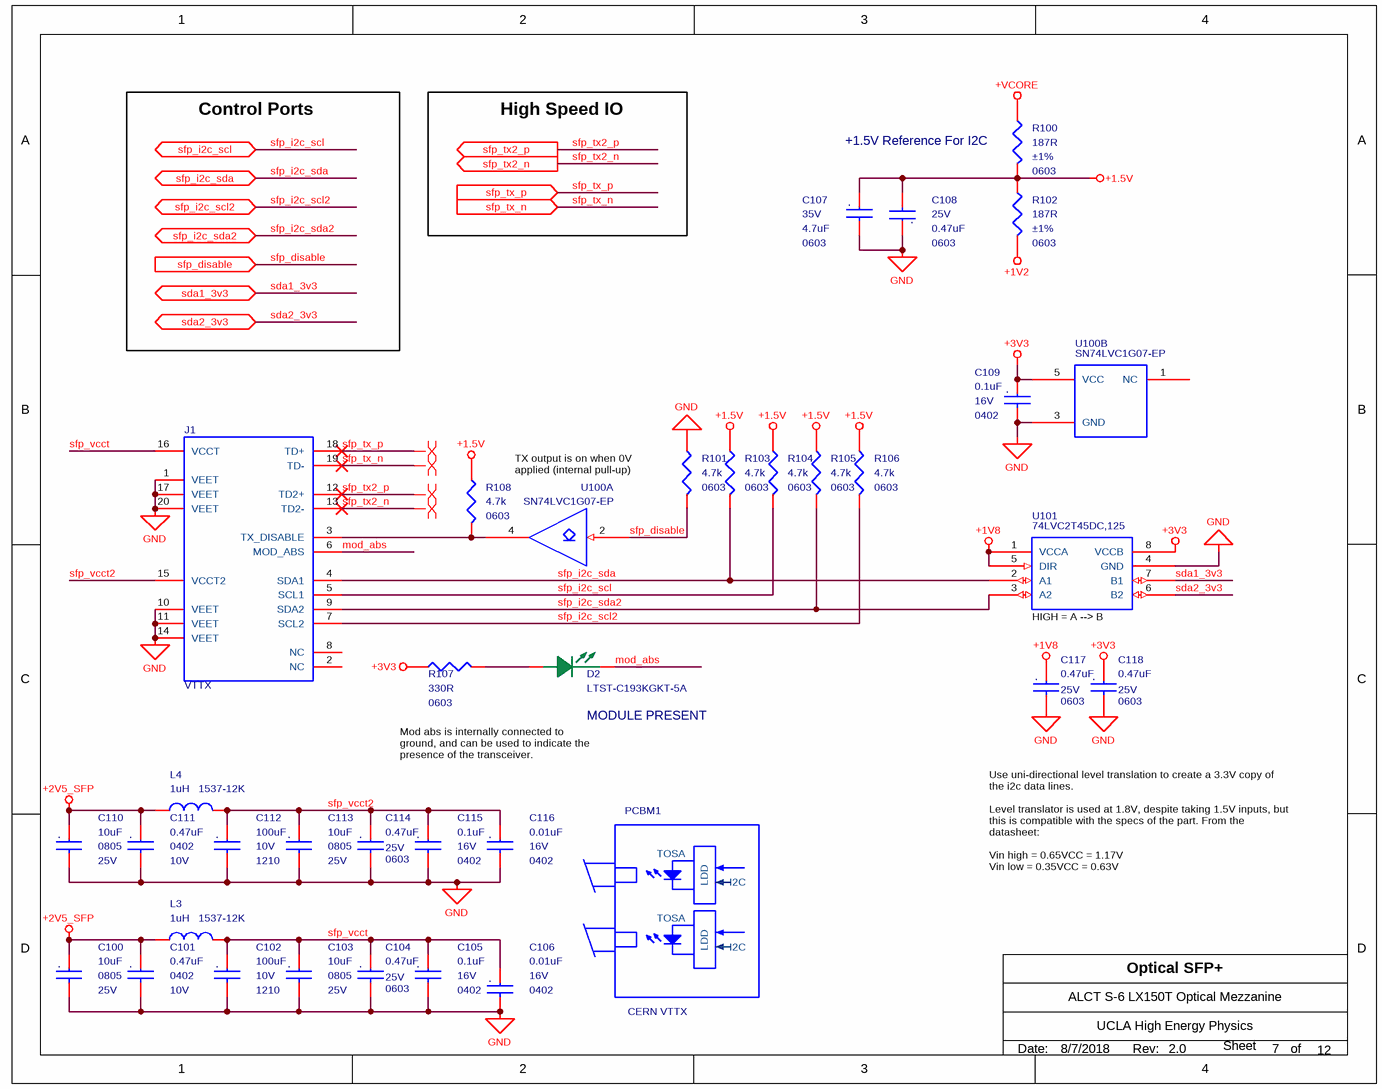
[diagram p11: VTTX.SchDoc]

### Parts
C100  10uF  Voltage - Rated: 25V  package: 0805  [MC_S6/SM/C_0805_IPC]
C101  0.47uF  Voltage - Rated: 10V  package: 0402  [MC_S6/SM/C_0402_IPC]
C102  100uF  Voltage - Rated: 10V  package: 1210  [MC_S6/SM/C_1210_IPC]
C103  10uF  Voltage - Rated: 25V  package: 0805  [MC_S6/SM/C_0805_IPC]
C104  0.47uF  Voltage - Rated: 25V  package: 0603  [MC_S6/SM/C_0603_IPC]
C105  0.1uF  package: 0402  Voltage - Rated: 16V  [MC_S6/SM/C_0402_IPC]
C106  0.01uF  Voltage - Rated: 16V  package: 0402  [MC_S6/SM/C_0402_IPC]
C107  4.7uF  Voltage - Rated: 35V  package: 0603  [MC_S6/SM/C_0603_IPC]
C108  0.47uF  Voltage - Rated: 25V  package: 0603  [MC_S6/SM/C_0603_IPC]
C109  0.1uF  package: 0402  Voltage - Rated: 16V  [MC_S6/SM/C_0402_IPC]
C110  10uF  Voltage - Rated: 25V  package: 0805  [MC_S6/SM/C_0805_IPC]
C111  0.47uF  Voltage - Rated: 10V  package: 0402  [MC_S6/SM/C_0402_IPC]
C112  100uF  Voltage - Rated: 10V  package: 1210  [MC_S6/SM/C_1210_IPC]
C113  10uF  Voltage - Rated: 25V  package: 0805  [MC_S6/SM/C_0805_IPC]
C114  0.47uF  Voltage - Rated: 25V  package: 0603  [MC_S6/SM/C_0603_IPC]
C115  0.1uF  package: 0402  Voltage - Rated: 16V  [MC_S6/SM/C_0402_IPC]
C116  0.01uF  Voltage - Rated: 16V  package: 0402  [MC_S6/SM/C_0402_IPC]
C117  0.47uF  Voltage - Rated: 25V  package: 0603  [MC_S6/SM/C_0603_IPC]
C118  0.47uF  Voltage - Rated: 25V  package: 0603  [MC_S6/SM/C_0603_IPC]
D2  LTST-C193KGKT-5A  [MC_S6/SM/LED_0603]
J1  VTTX  [MC_S6/SM/TE-1888247-1]
L3  1uH  [MC_S6/TH/DELEVAN1537]
L4  1uH  [MC_S6/TH/DELEVAN1537]
PCBM1  CERN VTTX  [PCBM_CERN_VTTX V2.1]
R100  187R  Tolerance: ±1%  Supplier Device Package: 0603  [MC_S6/SM/R_0603_IPC]
R101  4.7k  Supplier Device Package: 0603  [MC_S6/SM/R_0603_IPC]
R102  187R  Tolerance: ±1%  Supplier Device Package: 0603  [MC_S6/SM/R_0603_IPC]
R103  4.7k  Supplier Device Package: 0603  [MC_S6/SM/R_0603_IPC]
R104  4.7k  Supplier Device Package: 0603  [MC_S6/SM/R_0603_IPC]
R105  4.7k  Supplier Device Package: 0603  [MC_S6/SM/R_0603_IPC]
R106  4.7k  Supplier Device Package: 0603  [MC_S6/SM/R_0603_IPC]
R107  330R  Supplier Device Package: 0603  [MC_S6/SM/R_0603_IPC]
R108  4.7k  Supplier Device Package: 0603  [MC_S6/SM/R_0603_IPC]
U100  SN74LVC1G07-EP  [SOT353-1]  (parts A,B of 2)
U101  74LVC2T45DC,125  [VSSOP8 SOT765-1]

### Ports
sda1_3v3 (bidir), sda2_3v3 (bidir), sfp_disable (in), sfp_i2c_scl2 (bidir), sfp_i2c_scl (bidir), sfp_i2c_sda2 (bidir), sfp_i2c_sda (bidir), sfp_tx2_n (out), sfp_tx2_p (out), sfp_tx_n (in), sfp_tx_p (in)

### Nets
+1.5V: C107.1 C108.2 R100.2 R102.1 R103.1 R104.1 R105.1 R106.1 R108.1
+1V2: R102.2
+1V8: C117.1 U101.1(VCCA) U101.5(DIR)
+2V5_SFP: C100.1 C101.1 C110.1 C111.1 L3.2 L4.2
+3V3: C109.1 C118.1 R107.1 U100.5(VCC) U101.8(VCCB)
+Vcore: R100.1
GND: C100.2 C101.2 C102.2 C103.2 C104.2 C105.2 C106.2 C107.2 C108.1 C109.2 C110.2 C111.2 C112.2 C113.2 C114.2 C115.2 C116.2 C117.2 C118.2 J1.1(VEET) J1.10(VEET) J1.11(VEET) J1.14(VEET) J1.17(VEET) J1.20(VEET) R101.1 U100.3(GND) U101.4(GND)
mod_abs: D2.K(CATHODE) J1.6(MOD_ABS)
sda1_3v3: U101.7(B1) ; port sda1_3v3
sda2_3v3: U101.6(B2) ; port sda2_3v3
sfp_disable: R101.2 U100.2(A) ; port sfp_disable
sfp_i2c_scl: J1.5(SCL1) R104.2 ; port sfp_i2c_scl
sfp_i2c_scl2: J1.7(SCL2) R106.2 ; port sfp_i2c_scl2
sfp_i2c_sda: J1.4(SDA1) R103.2 U101.2(A1) ; port sfp_i2c_sda
sfp_i2c_sda2: J1.9(SDA2) R105.2 U101.3(A2) ; port sfp_i2c_sda2
sfp_tx2_n: J1.13(TD2-) ; port sfp_tx2_n
sfp_tx2_p: J1.12(TD2+) ; port sfp_tx2_p
sfp_tx_n: J1.19(TD-) ; port sfp_tx_n
sfp_tx_p: J1.18(TD+) ; port sfp_tx_p
sfp_vcct: C102.1 C103.1 C104.1 C105.1 C106.1 J1.16(VCCT) L3.1
sfp_vcct2: C112.1 C113.1 C114.1 C115.1 C116.1 J1.15(VCCT2) L4.1
NetD2_A: D2.A(ANODE) R107.2
NetJ1_3: J1.3(TX_DISABLE) R108.2 U100.4(Y)

Not connected (* = marked no-connect by the designer): J1 2(NC) 8(NC); U100 1(NC)

### Layout directives
differential pair: sfp_tx2_n, sfp_tx2_p, sfp_tx_n, sfp_tx_p

### Notes on the sheet
- Control Ports
- High Speed IO
- (near R100) +1.5V Reference For I2C
- TX output is on when 0V applied (internal pull-up)
- (near U101) HIGH = A --> B
- (near D2) MODULE PRESENT
- Mod abs is internally connected to ground, and can be used to indicate the presence of the transceiver.
- Use uni-directional level translation to create a 3.3V copy of the i2c data lines.
  Level translator is used at 1.8V, despite taking 1.5V inputs, but this is compatible with the specs of the part. From the datasheet:
  Vin high = 0.65VCC = 1.17V
  Vin low = 0.35VCC = 0.63V
- Date:
- Rev:
- of
- Sheet
- (in symbol C0402C103K4RACTU) .
- (in symbol C0402C104K4RACTU) .
- (in symbol GRM21BR61E106KA73L) .
- (in symbol GRM155R61A474KE15J) .
- (in symbol GRM188R6YA475KE15D) .
- (in symbol GRM188R71E474KA12D) .
- (in symbol LMK325BJ107MM-T) .
- (in symbol PCBM_CERN_VTTX V2.1_a) TOSA; LDD; I2C

### Library data of the parts
C100 C103 C110 C113 = GRM21BR61E106KA73L: as C82 on sheet MGT; Supplier 1: Digi-Key; Manufacturer Part Number: GRM21BR61E106KA73L; RoHS: RoHS Compliant; Category: Capacitors; Stock 1: 607428; Pricing 1: 1=0.19, 10=0.13, 50=0.0748, 100=0.0618, 250=0.052, 500=0.04356, 1000=0.03575 (USD); Packaging: Cut Tape (CT); Part Status: Active; Temperature Coefficient: X5R; Operating Temperature: -55°C ~ 85°C; Features: -; Ratings: -; Applications: General Purpose; Mounting Type: Surface Mount, MLCC; Package / Case: 0805 (2012 Metric); Size / Dimension: 0.079" L x 0.049" W (2.00mm x 1.25mm); Height - Seated (Max): -; Thickness (Max): 0.053" (1.35mm); Lead Spacing: -; Lead Style: -; ComponentLink1URL: http://www.murata.com/~/media/webrenewal/support/library/catalog/products/capacitor/mlcc/c02e.pdf; ComponentLink1Description: http://www.murata.com/~/media/webrenewal/support/library/catalog/products/capacitor/mlcc/c02e.pdf; Supplier 2: Digi-Key; Supplier Part Number 1: 490-5523-1-ND; Supplier Part Number 2: 490-5523-6-ND
C101 C111 = GRM155R61A474KE15J: as C83 on sheet MGT; Supplier 1: Digi-Key; Manufacturer Part Number: GRM155R61A474KE15J; RoHS: RoHS Compliant; Category: Capacitors; Stock 1: 35266; Pricing 1: 1=0.1, 10=0.074, 100=0.0329, 500=0.02348, 1000=0.01845, 2500=0.01678, 5000=0.01543 (USD); Packaging: Cut Tape (CT); Part Status: Active; Operating Temperature: -55°C ~ 85°C; Features: -; Ratings: -; Applications: General Purpose; Mounting Type: Surface Mount, MLCC; Package / Case: 0402 (1005 Metric); Size / Dimension: 0.039" L x 0.020" W (1.00mm x 0.50mm); Height - Seated (Max): -; Thickness (Max): 0.022" (0.55mm); Lead Spacing: -; ComponentLink1URL: http://www.murata.com/~/media/webrenewal/support/library/catalog/products/capacitor/mlcc/c02e.ashx; ComponentLink1Description: http://www.murata.com/~/media/webrenewal/support/library/catalog/products/capacitor/mlcc/c02e.ashx; Supplier 2: Digi-Key; Stock 2: 35286; Pricing 2: 1=0.1, 10=0.074, 100=0.0329, 500=0.02348, 1000=0.01845, 2500=0.01678, 5000=0.01543 (USD); Supplier Part Number 1: 490-6305-1-ND; Supplier Part Number 2: 490-6305-6-ND; Temperature Coefficient: X5R
C102 C112 = LMK325BJ107MM-T: as C86 on sheet MGT; Supplier 1: Digi-Key; Manufacturer Part Number: LMK325BJ107MM-T; RoHS: RoHS Compliant; Category: Capacitors; Stock 1: 345948; Pricing 1: 1=1.15, 10=0.909, 25=0.8332, 50=0.7878, 100=0.6818, 250=0.60608 (USD); Packaging: Cut Tape (CT); Part Status: Active; Operating Temperature: -55°C ~ 85°C; Mounting Type: Surface Mount, MLCC; Package / Case: 1210 (3225 Metric); Size / Dimension: 0.126" L x 0.098" W (3.20mm x 2.50mm); Height - Seated (Max): -; Lead Spacing: -; Features: -; ComponentLink1URL: http://www.yuden.co.jp/productdata/catalog/en/mlcc_all_e.pdf; ComponentLink1Description: http://www.yuden.co.jp/productdata/catalog/en/mlcc_all_e.pdf; Supplier 2: Digi-Key; Stock 2: 345948; Pricing 2: 1=1.16, 10=0.914, 25=0.8376, 50=0.792, 100=0.6855, 250=0.60932 (USD); Supplier Part Number 1: 587-1965-1-ND; Supplier Part Number 2: 587-1965-6-ND; Temperature Coefficient: X5R; Ratings: -; Applications: General Purpose; Thickness (Max): 0.106" (2.70mm); Lead Style: -
C104 C108 C114 C117 C118 = GRM188R71E474KA12D: CAP CER 0.47UF 25V X7R 0603; Manufacturer: Murata; Capacitance: 0.47µF; Tolerance: ±10%; Product Training Modules: High-Cap Multilayer Ceramic Capacitors; Featured Product: GA3 Safety Recognized Caps and Hi-Cap MLCC; Online Catalog: GRM Series; Other Names: 490-3291-2; Supplier 1: Digikey; Manufacturer Part Number: GRM188R71E474KA12D; Category: Capacitors; Stock 1: 616139; Pricing 1: 1=0.17, 10=0.114, 50=0.0656, 100=0.0542, 250=0.0456, 500=0.0382, 1000=0.0314 (USD); Packaging: Tape & Reel (TR); Operating Temperature: -55°C ~ 125°C; Features: -; Ratings: -; Applications: General Purpose; Mounting Type: Surface Mount, MLCC; Package / Case: 0603 (1608 Metric); Size / Dimension: 0.063" L x 0.031" W (1.60mm x 0.80mm); Height - Seated (Max): -; Thickness (Max): 0.035" (0.90mm); Lead Spacing: -; Lead Style: -; ComponentLink1URL: https://datasheet.ciiva.com/16293/grm188r71e474ka12d-16293088.pdf; ComponentLink1Description: https://datasheet.ciiva.com/16293/grm188r71e474ka12d-16293088.pdf; Supplier 2: Digikey; Stock 2: 616139; Pricing 2: 1=0.17, 10=0.114, 50=0.0656, 100=0.0542, 250=0.0456, 500=0.0382, 1000=0.0314 (USD); Supplier Part Number 1: 490-3291-1-ND; Supplier Part Number 2: 490-3291-6-ND; Temperature Coefficient: X7R; Standard Package: 4,000; Family: Ceramic Capacitors; Series: GRM; ComponentLink2URL: https://datasheet.ciiva.com/7937/1747458-7937650.pdf; ComponentLink2Description: https://datasheet.ciiva.com/7937/1747458-7937650.pdf; ComponentLink3URL: https://datasheet.ciiva.com/134/grm188r71e474ka12-01-134308.pdf; ComponentLink3Description: https://datasheet.ciiva.com/134/grm188r71e474ka12-01-134308.pdf; ComponentLink4URL: https://datasheet.ciiva.com/134/grm188r71e474ka12-01-134309.pdf; ComponentLink4Description: https://datasheet.ciiva.com/134/grm188r71e474ka12-01-134309.pdf; ComponentLink5URL: https://datasheet.ciiva.com/134/grm188r71e474ka12-01-134310.pdf; ComponentLink5Description: https://datasheet.ciiva.com/134/grm188r71e474ka12-01-134310.pdf; ComponentLink6URL: https://datasheet.ciiva.com/22703/1747458-22703340.pdf; ComponentLink6Description: https://datasheet.ciiva.com/22703/1747458-22703340.pdf; ComponentLink7URL: https://datasheet.ciiva.com/29199/454518-da-01-en-vs-kondensator-0603-29199596.pdf; ComponentLink7Description: https://datasheet.ciiva.com/29199/454518-da-01-en-vs-kondensator-0603-29199596.pdf; ComponentLink8URL: https://datasheet.ciiva.com/34302/1857559-34302862.pdf; ComponentLink8Description: https://datasheet.ciiva.com/34302/1857559-34302862.pdf
C105 C109 C115 = C0402C104K4RACTU: CAP CER 0.1UF 16V X7R 0402; Manufacturer: KEMET; Capacitance: 0.10µF; Tolerance: ±10%; Supplier 1: Digi-Key; Manufacturer Part Number: C0402C104K4RACTU; RoHS: RoHS Compliant; Category: Capacitors; Stock 1: 3565698; Pricing 1: 1=0.11, 10=0.078, 25=0.0568, 50=0.0442, 100=0.0365, 250=0.03024, 500=0.02562, 1000=0.02121, 5000=0.01806 (USD); Packaging: Cut Tape (CT); Part Status: Active; Operating Temperature: -55°C ~ 125°C; Features: -; Ratings: -; Applications: General Purpose; Failure Rate: -; Mounting Type: Surface Mount, MLCC; Package / Case: 0402 (1005 Metric); Size / Dimension: 0.039" L x 0.020" W (1.00mm x 0.50mm); Height - Seated (Max): -; Thickness (Max): 0.022" (0.55mm); Lead Spacing: -; Lead Style: -; ComponentLink1URL: http://www.kemet.com/docfinder?Partnumber=C0402C104K4RACTU; ComponentLink1Description: http://www.kemet.com/docfinder?Partnumber=C0402C104K4RACTU; Supplier 2: Digi-Key; Stock 2: 3565998; Pricing 2: 1=0.11, 10=0.078, 25=0.0568, 50=0.0442, 100=0.0365, 250=0.03024, 500=0.02562, 1000=0.02121, 5000=0.01806 (USD); Supplier Part Number 1: 399-3521-1-ND; Supplier Part Number 2: 399-3521-6-ND; Temperature Coefficient: X7R
C106 C116 = C0402C103K4RACTU: as C84 on sheet MGT; Supplier 1: Digi-Key; Manufacturer Part Number: C0402C103K4RACTU; RoHS: RoHS Compliant; Category: Capacitors; Stock 1: 605739; Pricing 1: 1=0.1, 10=0.02, 25=0.0144, 50=0.0108, 100=0.0088, 250=0.00732, 500=0.00626, 1000=0.00492, 5000=0.00412 (USD); Packaging: Cut Tape (CT); Part Status: Active; Temperature Coefficient: X7R; Operating Temperature: -55°C ~ 125°C; Features: -; Ratings: -; Applications: General Purpose; Failure Rate: -; Mounting Type: Surface Mount, MLCC; Package / Case: 0402 (1005 Metric); Size / Dimension: 0.039" L x 0.020" W (1.00mm x 0.50mm); Height - Seated (Max): -; Thickness (Max): 0.022" (0.55mm); Lead Spacing: -; Lead Style: -; ComponentLink1URL: http://www.kemet.com/docfinder?Partnumber=C0402C103K4RACTU; ComponentLink1Description: http://www.kemet.com/docfinder?Partnumber=C0402C103K4RACTU; Supplier 2: Digi-Key; Stock 2: 605739; Pricing 2: 1=0.1, 10=0.02, 25=0.0144, 50=0.0108, 100=0.0088, 250=0.00732, 500=0.00626, 1000=0.00492, 5000=0.00412 (USD); Supplier Part Number 1: 399-1038-1-ND; Supplier Part Number 2: 399-1038-6-ND
C107 = GRM188R6YA475KE15D: CAP CER 4.7UF 35V X5R 0603; Manufacturer: Murata; Product Training Modules: High-Cap Multilayer Ceramic Capacitors; Featured Product: GA3 Safety Recognized Capacitors; EDA / CAD Models: Download from Accelerated Designs; Capacitance: 4.7µF; Tolerance: ±10%; Online Catalog: GRM Series; Other Names: 490-7205-2; Supplier 1: Digikey; Manufacturer Part Number: GRM188R6YA475KE15D; Stock 1: 180441; Pricing 1: 1=0.32, 10=0.264, 50=0.1486, 100=0.132, 250=0.099, 500=0.0875, 1000=0.0776 (USD); Standard Package: 4,000; Category: Capacitors; Family: Ceramic Capacitors; Series: GRM; Packaging: Tape & Reel (TR); Temperature Coefficient: X5R; Mounting Type: Surface Mount, MLCC; Operating Temperature: -55°C ~ 85°C; Applications: General Purpose; Package / Case: 0603 (1608 Metric); Size / Dimension: 0.063" L x 0.031" W (1.60mm x 0.80mm); Thickness (Max): 0.031" (0.80mm); ComponentLink1URL: https://datasheet.ciiva.com/46444/1769893-46444984.pdf; ComponentLink1Description: https://datasheet.ciiva.com/46444/1769893-46444984.pdf; ComponentLink2URL: https://datasheet.ciiva.com/46444/1769893-46444985.pdf; ComponentLink2Description: https://datasheet.ciiva.com/46444/1769893-46444985.pdf; ComponentLink3URL: https://datasheet.ciiva.com/14906/partnumbering-e-01-14906426.pdf; ComponentLink3Description: https://datasheet.ciiva.com/14906/partnumbering-e-01-14906426.pdf; ComponentLink4URL: https://datasheet.ciiva.com/14906/partnumbering-e-01-14906427.pdf; ComponentLink4Description: https://datasheet.ciiva.com/14906/partnumbering-e-01-14906427.pdf; ComponentLink5URL: https://datasheet.ciiva.com/14906/partnumbering-e-01-14906428.pdf; ComponentLink5Description: https://datasheet.ciiva.com/14906/partnumbering-e-01-14906428.pdf; Supplier 2: Digikey; Stock 2: 180441; Pricing 2: 1=0.32, 10=0.264, 50=0.1486, 100=0.132, 250=0.099, 500=0.0875, 1000=0.0776 (USD); Supplier Part Number 1: 490-7205-1-ND; Supplier Part Number 2: 490-7205-6-ND
D2 = LTST-C193KGKT-5A: LED GREEN CLEAR 0603 SMD; Manufacturer: Lite-On Inc.; Lens Color: Colorless; Millicandela Rating: 16.25mcd; Lens Style/Size: Rectangle with Flat Top, 1.15mm x 0.80mm; Viewing Angle: 130°; Wavelength - Dominant: 572nm; Wavelength - Peak: 574nm; Voltage - Forward (Vf) (Typ): 2V; Current - Test: 5mA; Supplier 1: Digi-Key; Manufacturer Part Number: LTST-C193KGKT-5A; RoHS: RoHS Compliant; Category: Optoelectronics; Stock 1: 83440; Pricing 1: 1=0.41, 10=0.296, 25=0.2268, 100=0.148, 250=0.10852, 500=0.0921, 1000=0.07565, 2500=0.06578 (USD); Packaging: Cut Tape (CT); Part Status: Active; Color: Green; Lens Transparency: Clear; Mounting Type: Surface Mount; Features: -; Package / Case: 0603 (1608 Metric); Size / Dimension: 1.60mm L x 0.80mm W; Height (Max): 0.45mm; ComponentLink1URL: http://optoelectronics.liteon.com/upload/download/DS22-2007-0094/LTST-C193KGKT-5A.PDF; ComponentLink1Description: http://optoelectronics.liteon.com/upload/download/DS22-2007-0094/LTST-C193KGKT-5A.PDF; Supplier 2: Digi-Key; Stock 2: 83440; Pricing 2: 1=0.41, 10=0.296, 25=0.2268, 100=0.148, 250=0.10852, 500=0.0921, 1000=0.07565, 2500=0.06578 (USD); Supplier Part Number 1: 160-1828-1-ND; Supplier Part Number 2: 160-1828-6-ND; Supplier Device Package: Chip LED
J1 = VTTX: CONN FP+ CAGE 30AU SMD; Manufacturer: TE Connectivity AMP Connectors; Manufacturer Part Number: 1888247-1; Connector Style: Receptacle; Connector Type: SFP+; Number of Positions: 20; Supplier 1: Digi-Key; RoHS: RoHS Compliant; Category: Connectors, Interconnects; Stock 1: 23324; Pricing 1: 1=2.44, 10=2.21, 50=1.9844, 100=1.8942 (USD); Packaging: Cut Tape (CT); Part Status: Active; Mounting Type: Surface Mount, Right Angle; Termination: Solder; Features: Board Guide; Contact Finish: Gold; Contact Finish Thickness: 30µin (0.76µm); ComponentLink1URL: http://www.te.com/commerce/DocumentDelivery/DDEController?Action=srchrtrv&DocNm=1888247&DocType=Customer+Drawing&DocLang=English; ComponentLink1Description: http://www.te.com/commerce/DocumentDelivery/DDEController?Action=srchrtrv&DocNm=1888247&DocType=Customer+Drawing&DocLang=English; Supplier 2: Digi-Key; Stock 2: 23324; Pricing 2: 1=2.44, 10=2.21, 50=1.9844, 100=1.8942 (USD); Supplier Part Number 1: A97943CT-ND; Supplier Part Number 2: A97943DKR-ND
L3 L4 = 1537-12K: IND, Air Core, 1uH, 880mA, TH; Manufacturer: API Delevan Inc.; Material - Core: Phenolic; Inductance: 1µH; Tolerance: ±10%; Shielding: Unshielded; DC Resistance (DCR): 290 mOhm Max; Q @ Freq: 50 @ 25MHz; Frequency - Self Resonant: 200MHz; Notification: QPL or Military Specs are for reference only. Parts are not for military use. C of C not provided. See Terms and Conditions.; mfgr_id: 1537-12K; Supplier 1: Digi-Key; Manufacturer Part Number: 1537-12K; RoHS: RoHS non-compliant; Category: Inductors, Coils, Chokes; Stock 1: 1779; Pricing 1: 1=1.07, 10=0.997, 25=0.9208, 50=0.7672, 100=0.7212, 250=0.64444, 500=0.55238 (USD); Packaging: Cut Tape (CT); Part Status: Active; Type: -; Current Rating: 880mA; Current - Saturation: -; Ratings: -; Operating Temperature: -55°C ~ 125°C; Mounting Type: Through Hole; Package / Case: Axial; Supplier Device Package: Axial; Size / Dimension: 0.156" Dia x 0.375" L (3.96mm x 9.53mm); Height - Seated (Max): -; ComponentLink1URL: http://www.delevan.com/seriesPDFs/1537.pdf; ComponentLink1Description: http://www.delevan.com/seriesPDFs/1537.pdf; Supplier 2: Digi-Key; Stock 2: 1000; Pricing 2: 1000=0.44, 3000=0.42625, 5000=0.4125, 10000=0.39875, 25000=0.385 (USD); VALUE: 1uH; Supplier Part Number 1: 1134-1088-1-ND; Supplier Part Number 2: 1134-1088-2-ND
PCBM1 = PCBM_CERN_VTTX V2.1_a: Versatile Twin Transmitter Module; Device: VTTX-V2.1; PressFit: No; Bonding: No; Part Number: PCBM_CERN_VTTX V2.1_a; Component Kind: Standard; Component Type: Standard; PackageDescription: Versatile Twin Transmitter Module; Part Description: Versatile Twin Transmitter Module; Manufacturer: CERN; Manufacturer Part Number: VTTX-V2.1; Pin Count: 0; Mounted: Yes; Socket: No; SMD: No; Sense: No; ComponentHeight: 16.5mm; Author: CERN DEM JLC; HelpURL: \\cern.ch\dfs\Applications\Altium\Datasheets\PCBM_CERN_VTTX V2.1.pdf; CreateDate: 13/01/2014; LatestRevisionDate: 13/01/2014
R100 R102 = ERJ-3EKF1870V: RES SMD 187 OHM 1% 1/10W 0603; Manufacturer: Panasonic Electronic Components; Resistance (Ohms): 187; Power (Watts): 0.1W, 1/10W; Temperature Coefficient: ±100ppm/°C; Supplier 1: Digi-Key; Manufacturer Part Number: ERJ-3EKF1870V; RoHS: RoHS Compliant; Category: Resistors; Stock 1: 136341; Pricing 1: 1=0.1, 10=0.019, 25=0.0136, 50=0.0104, 100=0.0077, 250=0.00584, 500=0.00468, 1000=0.00345 (USD); Packaging: Cut Tape (CT); Part Status: Active; Composition: Thick Film; Features: Automotive AEC-Q200; Operating Temperature: -55°C ~ 155°C; Package / Case: 0603 (1608 Metric); Size / Dimension: 0.063" L x 0.031" W (1.60mm x 0.80mm); Height - Seated (Max): 0.022" (0.55mm); Number of Terminations: 2; Failure Rate: -; ComponentLink1URL: http://industrial.panasonic.com/www-cgi/jvcr13pz.cgi?E+PZ+3+AOA0002+ERJ3EKF1870V+7+WW; ComponentLink1Description: http://industrial.panasonic.com/www-cgi/jvcr13pz.cgi?E+PZ+3+AOA0002+ERJ3EKF1870V+7+WW; Supplier 2: Digi-Key; Stock 2: 136341; Pricing 2: 1=0.1, 10=0.019, 25=0.0136, 50=0.0104, 100=0.0077, 250=0.00584, 500=0.00468, 1000=0.00345 (USD); Supplier Part Number 1: P187HCT-ND; Supplier Part Number 2: P187HDKR-ND
R101 R103-R106 R108 = CR0603-FX-4701ELF: as R81-R83 on sheet MGT; Supplier 1: Digi-Key; Manufacturer Part Number: CR0603-FX-4701ELF; RoHS: RoHS Compliant; Category: Resistors; Stock 1: 43560; Pricing 1: 1=0.1, 10=0.021, 100=0.0086, 1000=0.00385, 2500=0.00334 (USD); Packaging: Cut Tape (CT); Part Status: Active; Resistance (Ohms): 4.7k; Composition: Thick Film; Features: Moisture Resistant; Operating Temperature: -55°C ~ 155°C; Package / Case: 0603 (1608 Metric); Size / Dimension: 0.063" L x 0.031" W (1.60mm x 0.80mm); Height - Seated (Max): 0.022" (0.55mm); Failure Rate: -; ComponentLink1URL: http://www.bourns.com/docs/Product-Datasheets/CHPREZTR.pdf; ComponentLink1Description: http://www.bourns.com/docs/Product-Datasheets/CHPREZTR.pdf; Supplier 2: Digi-Key; Stock 2: 43560; Pricing 2: 1=0.1, 10=0.021, 100=0.0086, 1000=0.00385, 2500=0.00334 (USD); Supplier Part Number 1: CR0603-FX-4701ELFCT-ND; Supplier Part Number 2: CR0603-FX-4701ELFDKR-ND; Tolerance: ±1%
R107 = CR0603-FX-3300ELF: RES SMD 330 OHM 1% 1/10W 0603; Manufacturer: Bourns Inc.; Resistance (Ohms): 330; Power (Watts): 0.1W, 1/10W; Temperature Coefficient: ±100ppm/°C; Tolerance: ±1%; Supplier 1: Digi-Key; Manufacturer Part Number: CR0603-FX-3300ELF; RoHS: RoHS Compliant; Category: Resistors; Stock 1: 45245; Pricing 1: 1=0.1, 10=0.023, 100=0.0092, 1000=0.00414, 2500=0.00359 (USD); Packaging: Cut Tape (CT); Part Status: Active; Composition: Thick Film; Features: Moisture Resistant; Operating Temperature: -55°C ~ 155°C; Package / Case: 0603 (1608 Metric); Size / Dimension: 0.063" L x 0.031" W (1.60mm x 0.80mm); Height - Seated (Max): 0.022" (0.55mm); Failure Rate: -; ComponentLink1URL: http://www.bourns.com/docs/Product-Datasheets/CHPREZTR.pdf; ComponentLink1Description: http://www.bourns.com/docs/Product-Datasheets/CHPREZTR.pdf; Supplier 2: Digi-Key; Stock 2: 45245; Pricing 2: 1=0.1, 10=0.023, 100=0.0092, 1000=0.00414, 2500=0.00359 (USD); Supplier Part Number 1: CR0603-FX-3300ELFCT-ND; Supplier Part Number 2: CR0603-FX-3300ELFDKR-ND
U100 = SN74LVC1G07-EP: IC BUFF/DVR NON-INVERT Open Drain SC70-5; Manufacturer: Texas Instruments; mfgr_id: SN74LVC1G07MDCKREP; mfgr: Texas Inst; mfgr_foot: DCK; COMPROT: 270; COMPGROUP: 0; COMPSIDE: TOP; Logic Type: Buffer, Non-Inverting; Number of Bits per Element: 1; Current - Output High, Low: -, 32mA; Voltage - Supply: 1.65 V ~ 5.5 V; Package: 99; Supplier 1: Digi-Key; Manufacturer Part Number: SN74LVC1G07MDCKREP; RoHS: RoHS Compliant; Category: Integrated Circuits (ICs); Stock 1: 4252; Pricing 1: 1=0.81, 10=0.714, 100=0.5472, 500=0.4326, 1000=0.34608 (USD); Packaging: Cut Tape (CT); Part Status: Active; Input Type: -; Output Type: Open Drain; Operating Temperature: -55°C ~ 125°C (TA); Mounting Type: Surface Mount; Package / Case: 5-TSSOP, SC-70-5, SOT-353; Supplier Device Package: SC-70-5; ComponentLink1URL: http://www.ti.com/lit/ds/symlink/sn74lvc1g07-ep.pdf; ComponentLink1Description: http://www.ti.com/lit/ds/symlink/sn74lvc1g07-ep.pdf; Supplier 2: Digi-Key; Stock 2: 4252; Pricing 2: 1=0.81, 10=0.714, 100=0.5472, 500=0.4326, 1000=0.34608 (USD); Supplier Part Number 1: 296-22343-1-ND; Supplier Part Number 2: 296-22343-6-ND
U101 = 74LVC2T45DC,125: IC TRNSLTR BIDIRECTIONAL 8VSSOP; Manufacturer: Nexperia USA Inc.; Translator Type: Voltage Level; Channels per Circuit: 2; Output Type: Tri-State, Non-Inverted; Data Rate: 420Mbps; Supplier 1: Digi-Key; Manufacturer Part Number: 74LVC2T45DC,125; RoHS: RoHS Compliant; Category: Integrated Circuits (ICs); Stock 1: 2495; Pricing 1: 1=0.58, 10=0.51, 100=0.3909, 500=0.309, 1000=0.2472 (USD); Packaging: Digi-Reel®; Part Status: Active; Channel Type: Bidirectional; Input Signal: -; Output Signal: -; Operating Temperature: -40°C ~ 125°C (TA); Features: -; Mounting Type: Surface Mount; Package / Case: 8-VFSOP (0.091", 2.30mm Width); Supplier Device Package: 8-VSSOP; Base Part Number: 74LVC2T45; ComponentLink1URL: https://assets.nexperia.com/documents/data-sheet/74LVC_LVCH2T45.pdf; ComponentLink1Description: https://assets.nexperia.com/documents/data-sheet/74LVC_LVCH2T45.pdf; Supplier Part Number 1: 1727-4578-6-ND